# EAGLE design lvc (EAGLE 7.6.0)
DOC_NUM: 1; REVISION: A
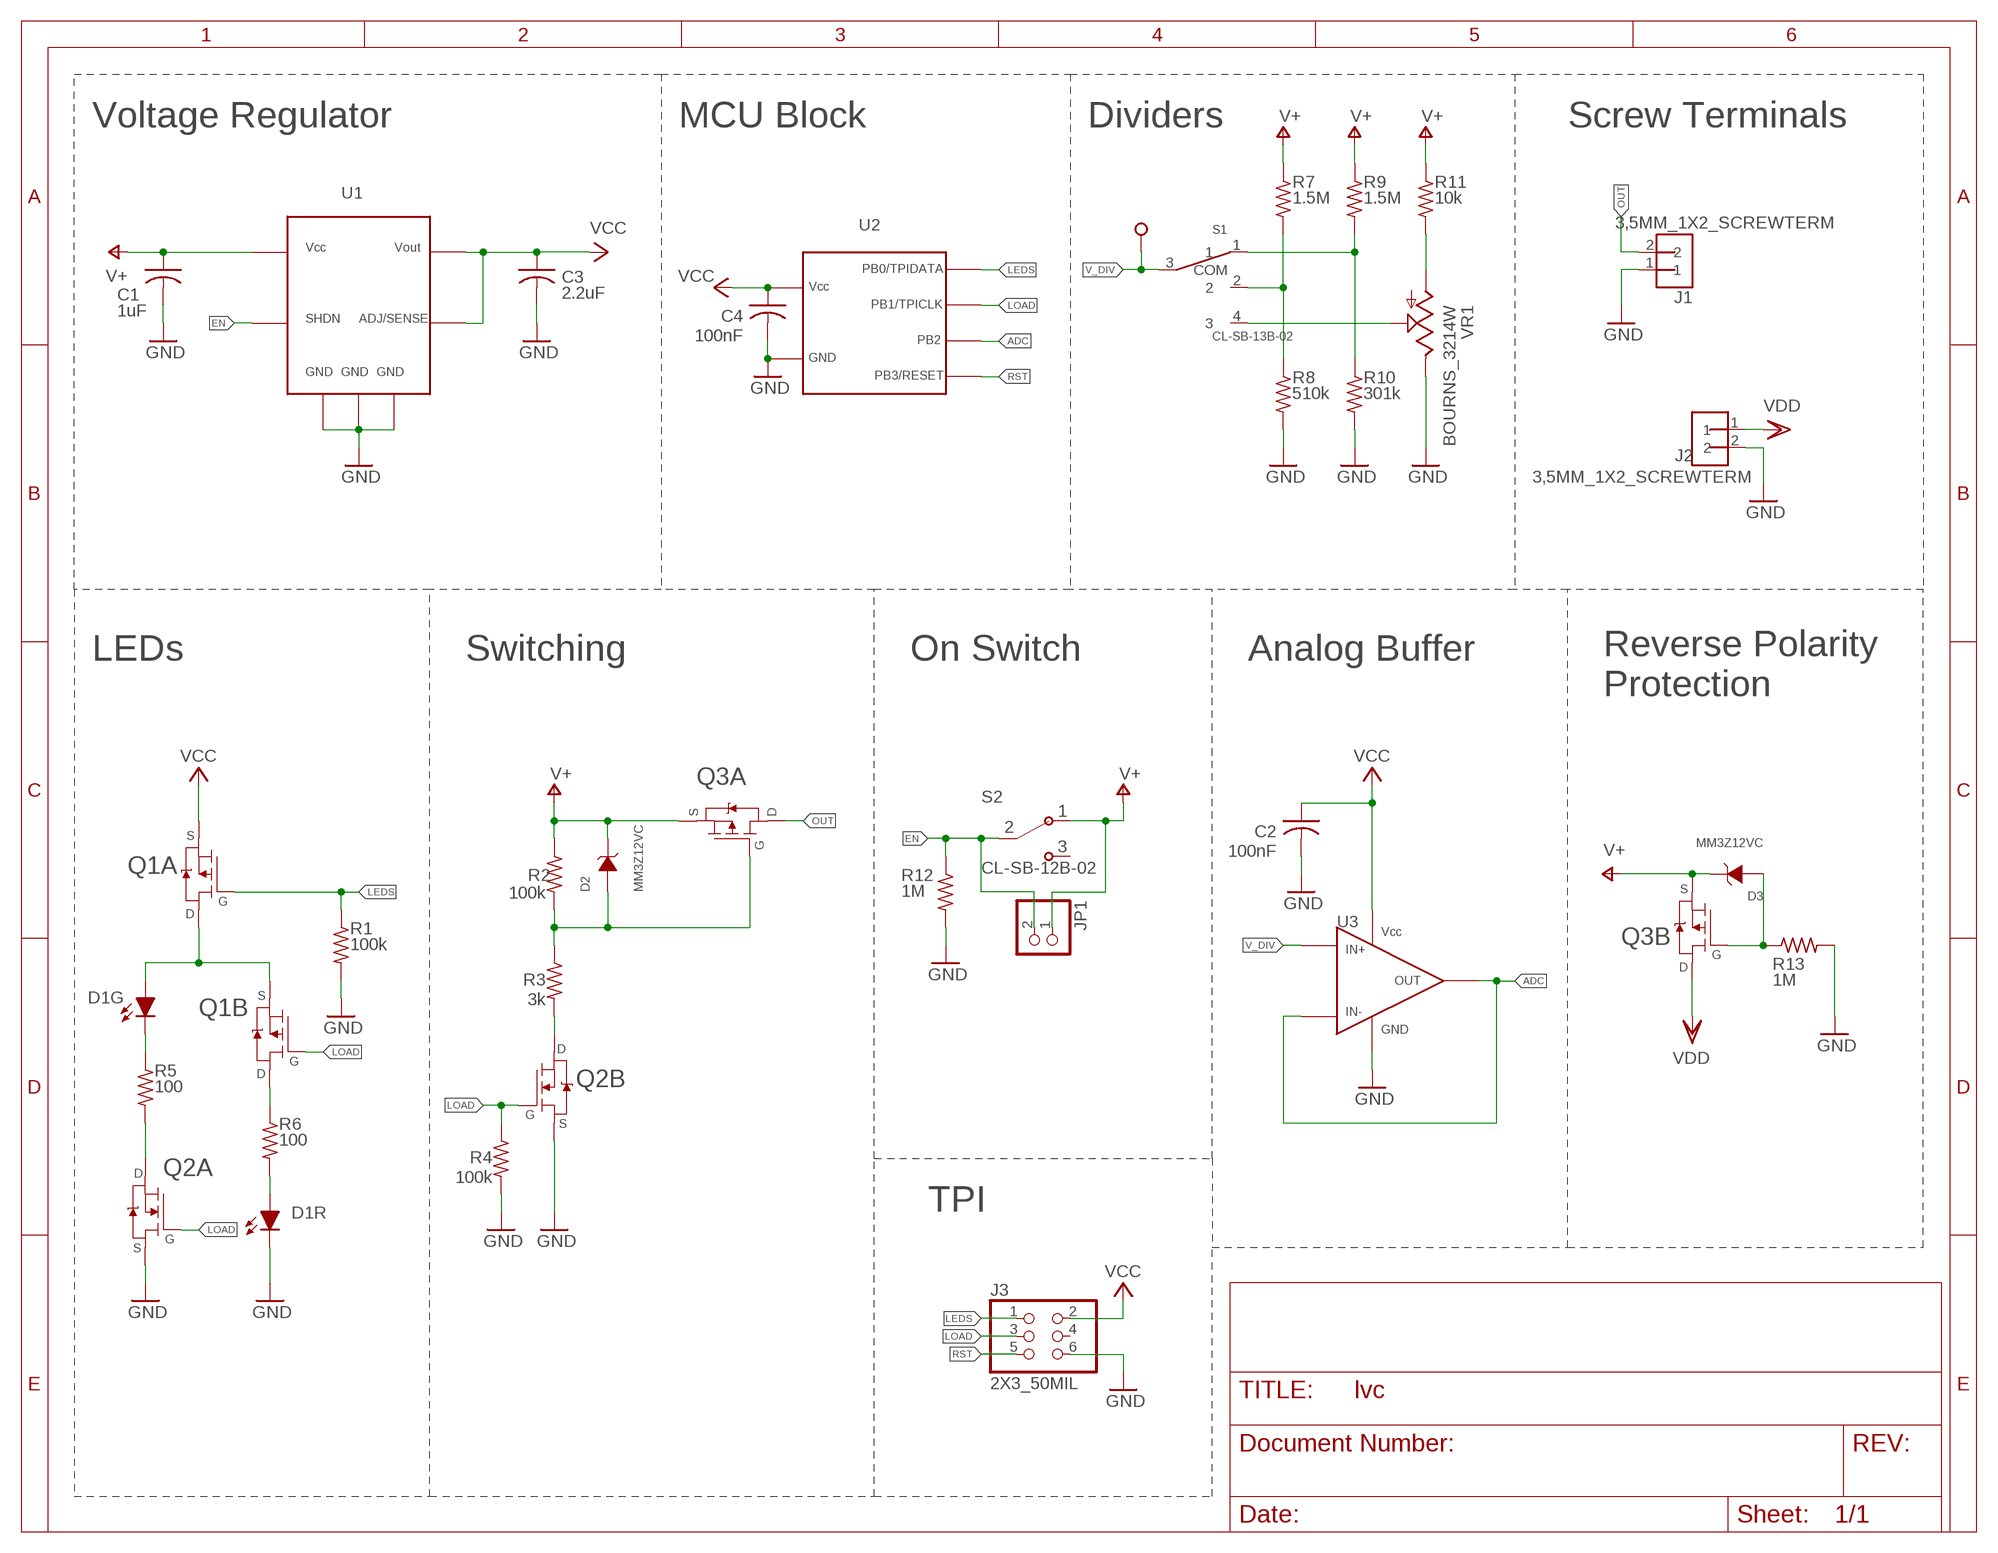
[diagram p0: schematic, sheet 1]

## Parts
C1  1uF  C-USC0603  [C0603]
C2  100nF  C-USC0603  [C0603]
C3  2.2uF  C-USC0603  [C0603]
C4  100nF  C-USC0603  [C0603]
D1  LED-R/G_150141RV73100  [4-PLCC]
D2  MM3Z12VC  [SOD-323F]
D3  MM3Z12VC  [SOD-323F]
J1  3,5MM_1X2_SCREWTERM  [3.5MM_1X2]
J2  3,5MM_1X2_SCREWTERM  [3.5MM_1X2]
J3  2X3_50MIL  [50MIL_2X3]
JP1  PINHD-1X2  [1X02]
Q1  FDC6312P  [SOT23-6]
Q2  PMGD280UN  [6-TSSOP]
Q3  SI7997DP  [POWERPAK-SO-8-DUAL]
R1  100k  R-US_R0603  [R0603]
R2  100k  R-US_R0603  [R0603]
R3  3k  R-US_R0603  [R0603]
R4  100k  R-US_R0603  [R0603]
R5  100  R-US_R0603  [R0603]
R6  100  R-US_R0603  [R0603]
R7  1.5M  R-US_R0603  [R0603]
R8  510k  R-US_R0603  [R0603]
R9  1.5M  R-US_R0603  [R0603]
R10  301k  R-US_R0603  [R0603]
R11  10k  R-US_R0603  [R0603]
R12  1M  R-US_R0603  [R0603]
R13  1M  R-US_R0603  [R0603]
S1  CL-SB-13B-02  [CL-SB-13B]
S2  CL-SB-12B-02  [CL-SB-12B]
TP1  TESTPOINT  [TP_2.5MM]
U1  LT3007  [SOT23-8]
U2  ATTINY5  [SOT23-6]
U3  LT1494  [8-MSOP]
VR1  BOURNS_3214W  [J-LEAD_TOP_ADJ]

## Nets
2_CELL: R7.2 R8.1 S1.2
3_CELL: R9.2 R10.1 S1.1
ADC: U2.4(PB2) U3.P$2(IN-) U3.P$6(OUT)
ADJ: S1.4 VR1.2(S)
EN: JP1.2 R12.1 S2.1 U1.1(SHDN)
GND: C1.2 C2.2 C3.2 C4.2 D1.3(R:C) J1.1 J2.2 J3.6 Q2.P$1(A:S) Q2.P$4(B:S) R1.2 R4.2 R8.2 R10.2 R12.2 R13.2 U1.2(GND1) U1.3(GND2) U1.4(GND3) U2.2(GND) U3.P$4(GND) VR1.3(E)
LEDS: J3.1 Q1.1(A:G) R1.1 U2.1(PB0/TPID)
LOAD: J3.3 Q1.3(B:G) Q2.P$2(A:G) Q2.P$5(B:G) R4.1 U2.3(PB1/TPICLK)
N$1: D1.4(G:C) R5.1
N$2: Q2.P$6(A:D) R5.2
N$3: D1.2(G:A) Q1.2(B:S) Q1.6(A:D)
N$4: Q1.4(B:D) R6.1
N$5: D2.1(A) Q3.4(A:G) R2.2 R3.1
N$6: D3.1(A) Q3.2(B:G) R13.1
N$7: Q2.P$3(B:D) R3.2
N$11: R11.2 VR1.1(A)
OUT: J1.2 Q3.5(A:D) Q3.5L(A:D) Q3.6(A:D)
RA: D1.1(R:A) R6.2
RST: J3.5 U2.6(PB3/RST)
V+: C1.1 D2.2(C) D3.2(C) JP1.1 Q3.1(B:S) Q3.3(A:S) R2.1 R7.1 R9.1 R11.1 S2.2 U1.5(VCC)
V_DIV: S1.3(COM) TP1.P$1 U3.P$3(IN+)
VCC: C2.1 C3.1 C4.1 J3.2 Q1.5(A:S) U1.7(OUT) U1.8(ADJ/SENSE) U2.5(VCC) U3.P$7(VCC)
VDD: J2.1 Q3.7(B:D) Q3.8(B:D) Q3.8L(B:D)
Unconnected: J3.4 S2.3

## Notes on the sheet
- Voltage Regulator | MCU Block | Dividers | Screw Terminals
- LEDs | Switching | On Switch | Analog Buffer
- Reverse Polarity
  Protection
- TPI

## Library data of the parts
C1-C4 = resistor:C-US: CAPACITOR, American symbol
D1 = AR_led:LED-R/G_
D2 D3 = NR_diode:MM3Z12VC
J1 J2 = NR_conn:3,5MM_1X2_SCREWTERM
J3 = NR_conn:2X3_50MIL
JP1 = pinhead:PINHD-1X2: PIN HEADER
Q1 = AR_transistor:FDC6312P
Q2 = AR_transistor:PMGD280UN
Q3 = AR_transistor:SI7997DP
R1-R13 = resistor:R-US_: RESISTOR, American symbol
S1 = NR_switch:CL-SB-13B-02
S2 = AR_switches:CL-SB-12B-02
TP1 = CM_test:TESTPOINT
U1 = AR_voltage_reg:LT3007
U2 = AR_mcu:ATTINY5
U3 = AR_op_amps:LT1494
VR1 = NR_pot:BOURNS_3214W

## Board
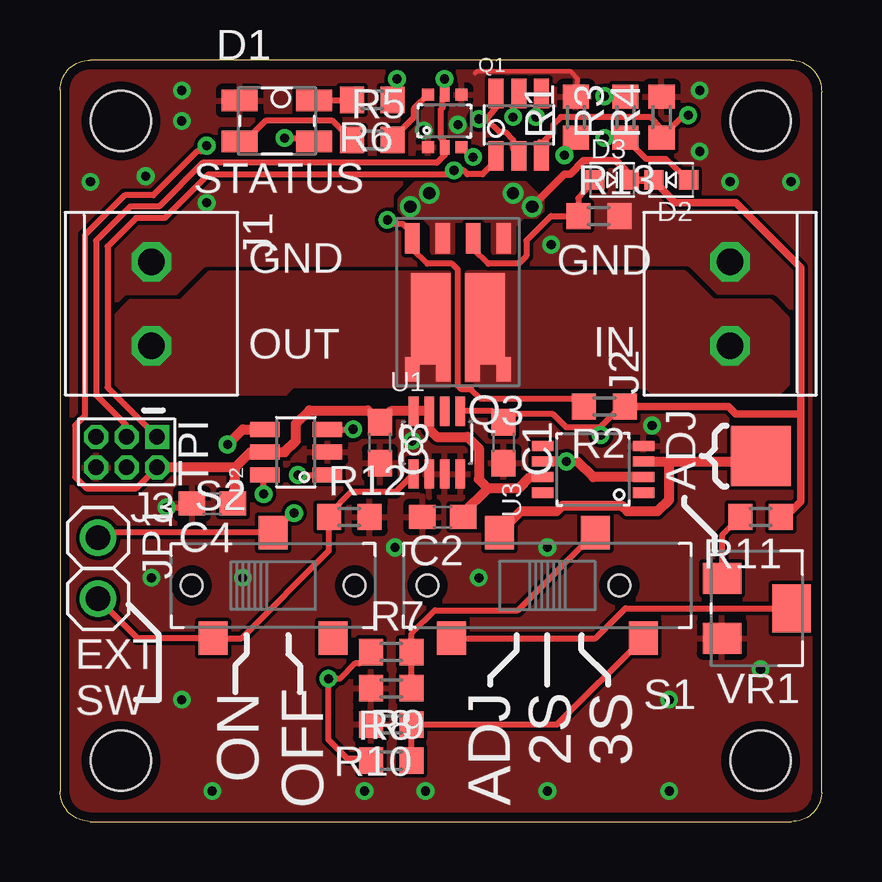
[diagram p1: board, top side]
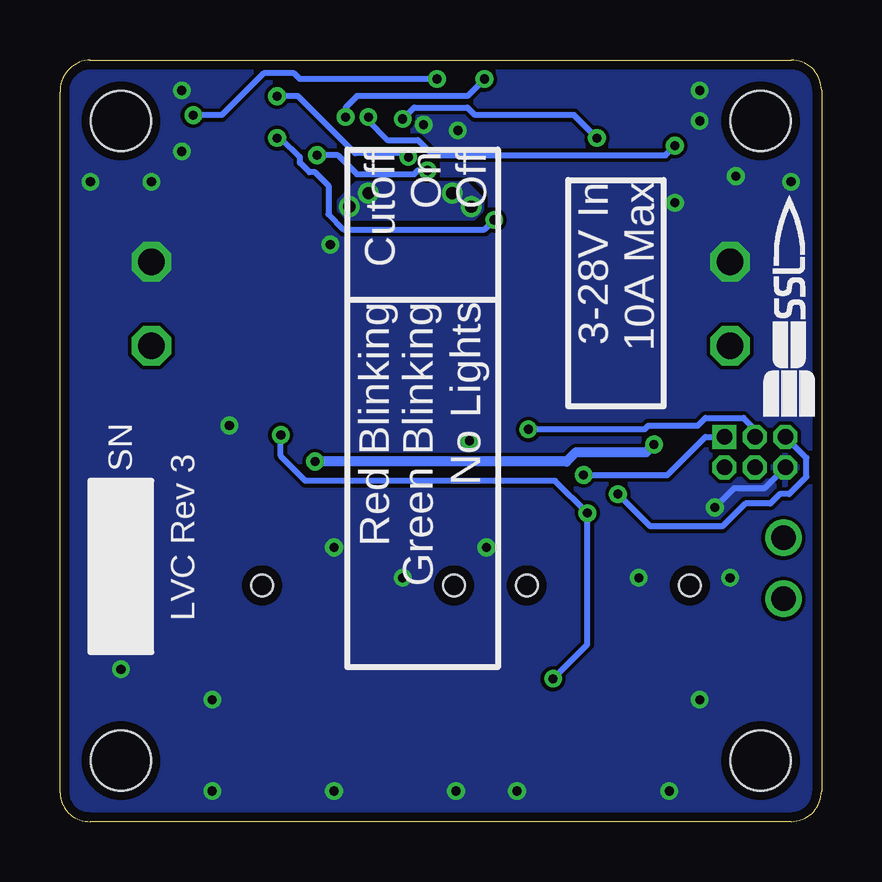
[diagram p2: board, bottom side, seen from below]

Size 31.75 x 31.75 mm. Coordinates in mm from the lower left corner, seen from the top.
Outline: 1.27,0 30.48,0 arc90 31.75,1.19 31.75,30.4 arc90 30.48,31.75 1.27,31.75 arc90 0,30.48 0,1.27 arc90 1.27,0
Copper layers (1*16): Top 0.0356mm / dielectric 1.5011mm / Bottom 0.0356mm
Design rules "LaenPCBOrder *": minimum track width 6mil, minimum drill 13mil, track to track 6mil, track to pad 6mil, pad to pad 6mil, via to via 6mil, smd to smd 6mil, copper to edge 15mil, drill to drill 6mil, minimum pad ring 7mil, minimum via ring 7mil, stop-mask expansion 4mil, vias tented up to drill 20mil, thermal gap 10mil
Holes 2.5 mm at 2.54,29.21 29.21,29.21 29.21,2.54 2.54,2.54

### Footprints (pad centres in the part's own frame; a part is rotated, then mirrored left to right if it is on the bottom)
C0603 = smd 1.1 x 1: 1 -0.85,0; 2 0.85,0
4-PLCC = smd 1.5 x 0.9: 1 1.55,0.85; 2 1.55,-0.85; 3 -1.55,0.85; 4 -1.55,-0.85
SOD-323F = smd 0.8 x 0.8: 1 -0.725,0; 2 0.725,0
3.5MM_1X2 = drill 1.1 octagon: 1 -1.75,0; 2 1.75,0
50MIL_2X3 = drill 0.65 square: 1 -1.27,0 | drill 0.65 octagon: 2 -1.27,1.27; 3 0,0; 4 0,1.27; 5 1.27,0; 6 1.27,1.27
1X02 = drill 1.016: 1 -1.27,0; 2 1.27,0
SOT23-6 = smd 0.62 x 1.23: 1 -0.95,-1.31; 2 0,-1.31; 3 0.95,-1.31; 4 0.95,1.31; 5 0,1.31; 6 -0.95,1.31
6-TSSOP = smd 0.5 x 0.5: P$1 -0.7,-1.1; P$3 0.7,-1.1; P$4 0.7,1.1; P$6 -0.7,1.1 | smd 0.4 x 0.6: P$2 0,-1.1; P$5 0,1.1
POWERPAK-SO-8-DUAL = smd 0.61 x 1.27: 1 -1.905,-2.725; 2 -0.635,-2.725; 3 0.635,-2.725; 4 1.905,-2.725 | smd 0.61 x 1.02: 5 1.905,2.74; 8 -1.905,2.74 | smd 1.65 x 3.81: 5L 1.13,0.635; 8L -1.13,0.635 | smd 0.61 x 0.71: 6 0.61,2.895; 7 -0.61,2.895
R0603 = smd 1 x 1.1: 1 -0.85,0; 2 0.85,0
CL-SB-13B = smd 1.2 x 1.4: 1 -4,2.2; 2 -2,-2.2; 3 2,-2.2; 4 4,2.2 | hole 0.9: -3,0; 5,0
CL-SB-12B = smd 1.2 x 1.4: 1 -2.5,-2.2; 2 0,2.2; 3 2.5,-2.2 | hole 0.9: -3.4,0; 3.4,0
TP_2.5MM = smd 2.5 x 2.5: P$1 0,0
SOT23-8 = smd 0.4 x 1.22: 1 -0.975,-1.31; 2 -0.325,-1.31; 3 0.325,-1.31; 4 0.975,-1.31; 5 0.975,1.31; 6 0.325,1.31; 7 -0.325,1.31; 8 -0.975,1.31
8-MSOP = smd 0.42 x 0.889: P$1 -0.975,-2.107; P$2 -0.325,-2.107; P$3 0.325,-2.107; P$4 0.975,-2.107; P$5 0.975,2.107; P$6 0.325,2.107; P$7 -0.325,2.107; P$8 -0.975,2.107
J-LEAD_TOP_ADJ = smd 1.6 x 1.3: 1 1.45,-1.25; 3 1.45,1.25 | smd 1.6 x 2: 2 -1.45,0

### Placement (x,y rotation side)
C1  18.49,15.8 270 top
C2  15.95,12.7 180 top
C3  13.34,15.8 270 top
C4  6.35,13.26 180 top
D1  9.05,29.21 0 top
D2  25.48,26.75 180 top
D3  23.02,26.75 0 top
J1  3.81,21.59 270 top
J2  27.94,21.59 90 top
J3  2.78,16.03 180 top
JP1  1.59,10.56 270 top
Q1  19.13,29.05 0 top
Q2  16.03,29.21 0 top
Q3  16.59,21.59 180 top
R1  21.51,29.37 90 top
R2  22.7,17.3 180 top
R3  23.57,29.37 90 top
R4  25.08,29.37 90 top
R5  13.02,28.42 0 top
R6  13.02,30.08 180 top
R7  13.81,7.06 0 top
R8  13.81,5.56 180 top
R9  13.81,2.54 0 top
R10  13.81,4.05 180 top
R11  29.21,12.7 180 top
R12  12.06,12.7 0 top
R13  22.46,25.24 0 top
S1  20.32,9.84 180 top
S2  8.89,9.84 0 top
TP1  29.21,15.24 0 top
U1  15.72,15.8 0 top
U2  9.84,15.4 90 top
U3  22.23,14.68 90 top
VR1  29.05,8.89 180 top

### Tracks (layer width: path | path; a pad name or v marks a point on that pad's centre or on a via)
2_CELL
  Top 0.254: R8.1 R7.2 14.66,7.83 15.64,8.81 19.09,8.81 S1.2
3_CELL
  Top 0.254: R9.2 R10.1 20.73,4.05 S1.1
ADC  (via drill 0.38)
  Top 0.406: U3.P$2 22.23,14.36 21.58,15.01 v21.11,15.01 U3.P$6 | v6.99,15.72 7.62,16.35 U2.4
  Bottom 0.406: v21.11,15.01 10.63,15.01 10.24,15.4 7.3,15.4 v6.99,15.72
ADJ
  Top 0.254: S1.4 22.33,7.64 23.57,8.89 VR1.2
EN
  Top 0.254: JP1.2 3.23,7.64 S2.1 7.56,7.64 11.21,11.29 R12.1 11.21,12.8 12.14,13.73 13.99,13.73 U1.1
GND  (via drill 0.38)
  Top 0.178: 17.3,31.19 17.38,31.27 21.27,31.27 21.59,30.96
  Top 0.203: R1.2 21.59,30.96
  Top 0.254: v4.45,13.1 5.34,13.1 C4.2
  Bottom 0.254: J3.6 2.38,13.89 3.65,13.89 v4.45,13.1
  other vias: 14.68,15.88 24.69,16.51 30.48,26.67 27.94,26.67 26.67,27.94 26.67,30.48 1.27,26.67 3.57,26.91 5.08,29.21 5.08,30.48 6.35,1.27 5.08,5.08 12.7,1.27 15.24,1.27 20.32,1.27 25.4,1.27 25.4,5.08 29.21,6.35 17.46,10.16 20.32,11.43 13.97,11.43 7.62,10.16 3.81,10.16 6.11,25.8 20.48,24.05 15.16,28.81 16.59,29.05
  pour Top (rank 3, no thermals): 29.37,22.15 25.48,22.15 23.73,23.89 18.65,23.89 17.86,24.69 13.26,24.69 10.48,21.91 2.54,21.91 2.54,25.08 3.97,26.51 24.05,26.51 26.04,24.53 29.21,24.53
  pour Bottom (rank 3, no thermals): 29.21,22.3 25.32,22.3 23.73,23.89 18.65,23.89 17.86,24.69 13.26,24.69 10.48,21.91 2.54,21.91 2.54,25.08 3.97,26.51 24.05,26.51 26.04,24.53 29.21,24.53
  pour Top (rank 6): -1.27,33.02 33.02,33.02 33.02,-1.27 -1.27,-1.27
  pour Bottom (rank 6): -2.54,34.29 34.29,34.29 34.29,-2.54 -2.54,-2.54
LEDS  (via drill 0.38)
  Top 0.254: Q1.1 18.1,27.47 17.62,26.99 16.99,26.99 16.83,27.15 v16.43,27.15 16.27,26.99 6.19,26.99 4.37,25.16 3.17,25.16 1.98,23.97 1.98,18.1 J3.1 | v21.03,27.78 21.11,28.04 R1.1 | v9.92,14.45 U2.1
  Bottom 0.254: v21.03,27.78 20.16,27.78 19.37,26.99 16.99,26.99 16.83,27.15 v16.43,27.15 | v9.92,14.45 6.43,14.45 4.84,16.03 J3.1
LOAD  (via drill 0.38)
  Top 0.254: 20,28.33 Q1.3 20.08,28.25 20.56,28.73 20.56,29.05 20.88,29.37 24.61,29.37 25.08,28.89 R4.1 26.01,29.45 v26.19,29.45 | v16.03,30.96 Q2.P$5 15.95,30.23 15.95,29.77 15.88,29.69 15.88,28.5 16.03,28.34 Q2.P$2 16.03,27.78 15.72,27.46 5.95,27.46 4.13,25.64 2.94,25.64 1.51,24.21 1.51,17.78 2.78,16.51 J3.3 | U2.3 v12.22,16.35
  Bottom 0.254: v26.19,29.45 25,29.45 23.26,31.19 21.99,31.19 21.75,30.96 v16.03,30.96 | v12.22,16.35 7.38,16.35 7.22,16.51 5.16,16.51 4.84,16.83 3.25,16.83 2.78,16.35 J3.3
N$1
  Top 0.254: R5.1 11.37,29.21 8.57,29.21 7.72,28.36 D1.4
N$2
  Top 0.254: R5.2 13.87,28.47 14.76,29.37 14.76,29.74 Q2.P$6
N$3  (via drill 0.38)
  Top 0.254: v17.46,29.29 17.78,29.29 | 17.78,29.29 18.18,29.77 Q1.6 | Q1.2 18.89,28.06 18.89,28.42 18.57,28.73 18.34,28.73 17.78,29.29 | 10.77,28.36 D1.2 10.46,28.5 v9.37,28.5
  Bottom 0.254: v9.37,28.5 10.32,29.45 14.45,29.45 14.76,29.77 16.99,29.77 v17.46,29.29
N$4  (via drill 0.38)
  Top 0.254: Q1.4 20.08,30.04 19.84,29.8 v19.84,29.37 | R6.1 14.05,30.03 v14.05,30.96
  Bottom 0.254: v14.05,30.96 14.76,30.24 19.37,30.24 19.84,29.77 v19.84,29.37
N$5  (via drill 0.38)
  Top 0.254: D2.1 25.25,27.62 24.45,27.62 23.57,28.5 R3.1 22.72,28.52 v22.7,28.5 | R2.2 21.53,17.62 17.54,17.62 17.14,18.02 16.75,18.02 16.59,18.18 16.59,23.02 16.35,23.26 15.32,23.26 14.68,23.89 Q3.4 14.68,24.53 14.29,24.92 13.81,24.92 v13.65,25.08
  Bottom 0.254: v13.65,25.08 14.05,24.69 19.92,24.69 20.56,25.32 20.56,26.51 21.11,27.07 21.35,27.07 21.75,27.46 21.75,27.7 22.54,28.5 v22.7,28.5
N$6
  Top 0.254: Q3.2 17.22,23.89 17.86,23.26 19.13,23.26 19.45,23.57 19.45,24.21 20.48,25.24 R13.1 21.61,25.99 D3.1
N$7  (via drill 0.38)
  Top 0.254: v22.7,30.24 23.44,30.24 R3.2 | Q2.P$3 17.14,27.7 v17.22,27.7
  Bottom 0.254: v22.7,30.24 21.83,30.24 19.45,27.86 17.46,27.86 17.3,27.7 v17.22,27.7
N$11
  Top 0.254: R11.2 27.6,11.94 VR1.1
OUT
  pour Top (no thermals): 2.3,21.03 2.94,21.67 5.08,21.67 6.27,22.86 16.19,22.86 16.19,18.18 9.68,18.18 9.37,17.86 2.78,17.86 2.3,18.34
RA
  Top 0.254: 10.65,30 D1.1 12.27,30.06 R6.2
RST  (via drill 0.38)
  Top 0.254: v8.49,13.65 8.49,14.41 U2.6
  Bottom 0.254: J3.5 0.64,15.16 0.64,14.37 1.35,13.65 1.75,13.65 2.14,13.26 3.17,13.26 4.13,12.3 7.14,12.3 v8.49,13.65
V+  (via drill 0.38, 0.51)
  Top 0.254: U1.5 18.03,17.11 C1.1 18.55,16.65 18.89,16.99 20.56,16.99 21.11,16.43 22.52,16.43 | JP1.1 1.8,12.04 S2.2 9.71,12.86 v9.76,12.86 | R9.1 12.88,2.62 11.99,2.62 11.19,3.41 v11.19,5.95 11.67,5.95 12.3,6.59 12.48,6.59 R7.1 | v22.54,16.11 22.52,16.14 22.52,16.43 | 22.52,16.43 23.39,17.3
  Top 0.305: 30.88,16.99 30.88,23.1 28.18,25.8 25.63,25.8 D2.2 23.97,26.75 | 30.88,16.99 30.88,13.34 30.24,12.7 | v19.68,25.64 21.03,26.99 21.27,26.99 21.83,27.54 23.18,27.54 23.97,26.75 | R2.1 27.86,17.3 28.18,16.99 30.88,16.99 | 23.97,26.75 D3.2
  Top 0.406: 30.24,12.7 R11.1 | 23.39,17.3 R2.1
  Bottom 0.254: v11.19,5.95 9.76,7.38 v9.76,12.86 11.11,14.21 21.51,14.21 22.54,15.24 v22.54,16.11
  other vias: 15.4,26.19 14.61,25.64 18.89,26.19
  pour Top (no thermals): 16.35,23.73 15.56,23.73 15.56,24.84 15.16,25.24 14.45,25.24 14.21,25.48 14.21,25.96 14.84,26.59 19.37,26.59 20.08,25.88 20.08,25.48 19.84,25.24 19.29,25.24 18.89,24.84 18.89,23.73 18.1,23.73 18.1,25.08 16.35,25.08
  pour Bottom: 14.21,25.48 14.53,25.16 19.76,25.16 20.08,25.48 20.08,25.88 19.37,26.59 14.84,26.59 14.21,25.96
V_DIV
  Top 0.406: S1.3 19.22,12.94 20.72,12.94 20.95,13.18 23.42,13.18 23.65,12.94 24.92,12.94 25.4,13.41 25.4,15.01 | U3.P$3 25.4,15.01 | 25.4,15.01 28.98,15.01 TP1.P$1
VCC  (via drill 0.38)
  Top 0.254: v18.89,29.37 18.89,29.84 19.13,30.08 Q1.5 | v6.11,28.18 5.87,27.94 5.71,27.94 3.89,26.11 2.7,26.11 1.03,24.45 1.03,16.91 0.64,16.51 0.64,14.37 1.11,13.89 3.17,13.89 J3.2
  Top 0.406: U3.P$7 19.6,14.36 19.13,13.89 17.84,13.89 | 17.84,13.89 17.46,14.26 17.46,15.56 16.99,16.03 15.72,16.03 15.39,16.36 U1.7 U1.8 13.79,17.11 C3.1 12.84,17.14 10.4,17.14 9.84,16.59 9.84,15.88 9.37,15.4 U2.5 7.94,15.4 7.3,14.76 | C2.1 16.8,12.86 17.84,13.89 | 7.3,14.76 J3.2 | C4.1 7.3,13.36 7.3,14.76
  Bottom 0.254: v18.89,29.37 18.89,29.21 18.1,28.42 16.83,28.42 16.19,27.78 6.51,27.78 v6.11,28.18
VDD
  pour Top (no thermals): 30.32,20.95 29.61,21.67 27.23,21.67 26.04,22.86 16.99,22.86 16.99,18.18 24.45,18.18 24.77,17.86 30,17.94 30.32,18.26

### Text on the board
tPlace: STATUS | GND | GND | OUT | IN | TPI | ADJ | OFF | ON | ADJ | 2S | 3S | EXT / SW
bPlace: Cutoff / On / Off | 3-28V In / 10A Max | No Lights | Green Blinking | Red Blinking | LVC Rev 3 | SN
Document: 2oz Copper / FR-4 or 408 / 1.0±0.1 Via plate thickness